# Altium schematic sheet Connectors.SchDoc
size A3
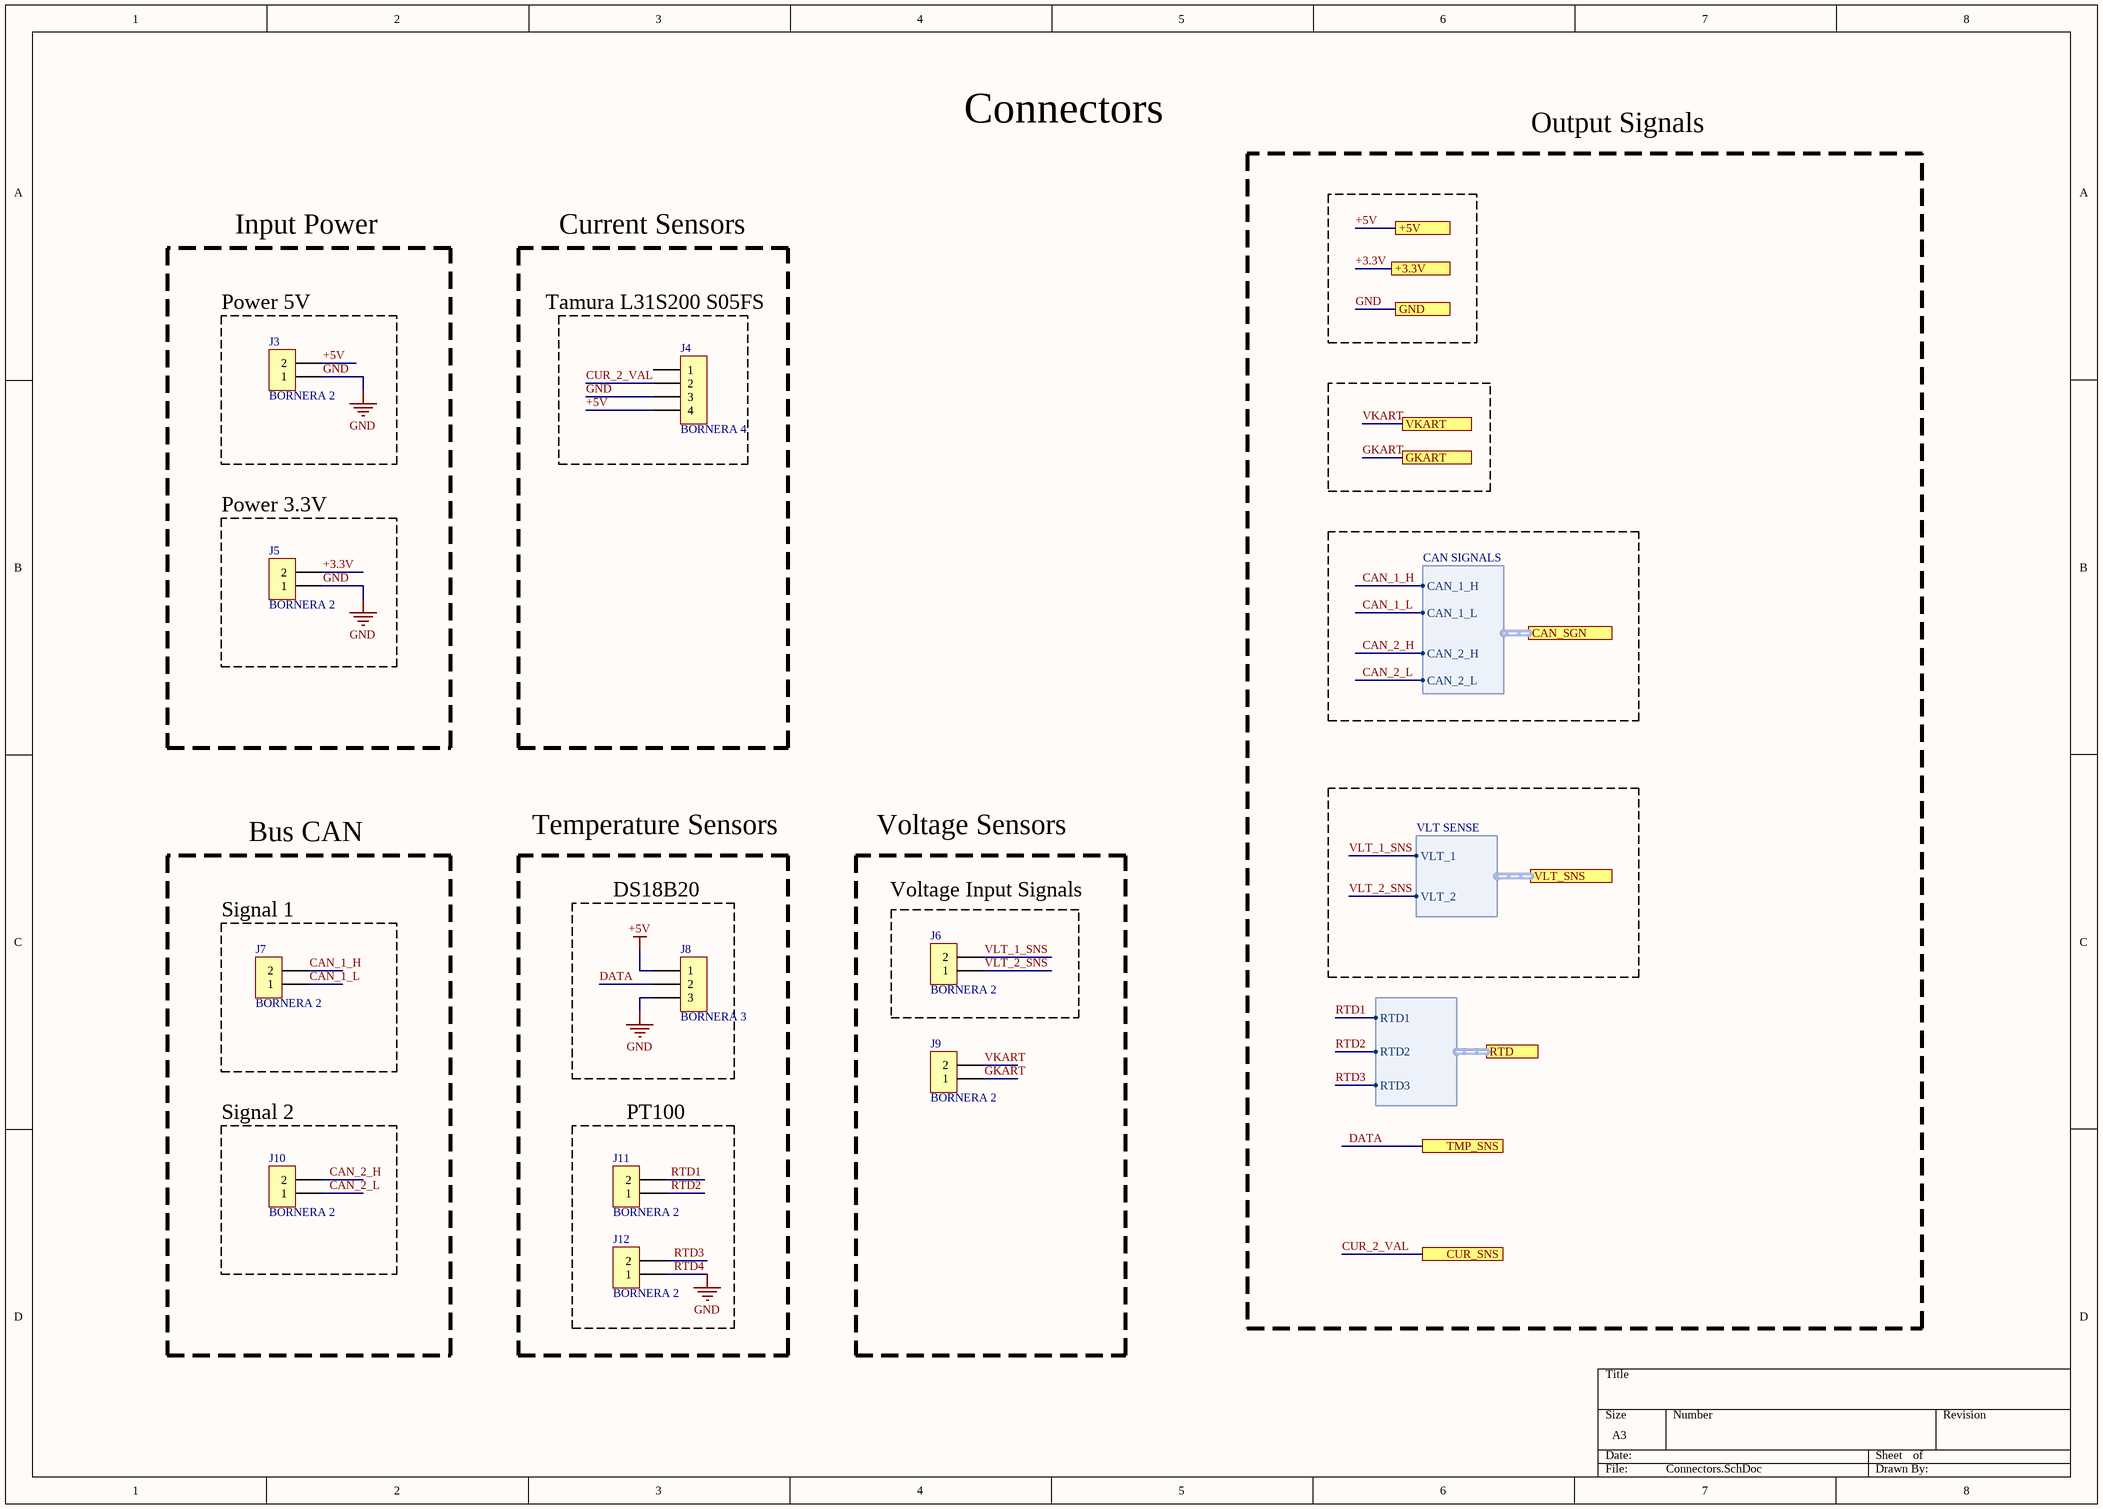
[diagram p0: Connectors.SchDoc]

## Parts
J3  BORNERA 2  [BORNERA2]
J4  BORNERA 4  [BORNERA4]
J5  BORNERA 2  [BORNERA2]
J6  BORNERA 2  [BORNERA2]
J7  BORNERA 2  [BORNERA2]
J8  BORNERA 3  [BORNERA3]
J9  BORNERA 2  [BORNERA2]
J10  BORNERA 2  [BORNERA2]
J11  BORNERA 2  [BORNERA2]
J12  BORNERA 2  [BORNERA2]

## Blocks framed on the sheet
Current Sensors: J4
Power 5V: J3
Power 3.3V: J5
Voltage Sensors: J9
Signal 1: J7
DS18B20: J8
Voltage Input Signals: J6
Signal 2: J10
PT100: J11 J12

## Ports
+3.3V, +5V, CAN_SGN (harness CAN SIGNALS), CUR_SNS, GKART, GND, RTD (harness *), TMP_SNS, VKART, VLT_SNS (harness VLT SENSE)

## Harnesses
?: RTD1, RTD2, RTD3
CAN SIGNALS: CAN_1_H, CAN_1_L, CAN_2_H, CAN_2_L
VLT SENSE: VLT_1, VLT_2

## Nets
+5V: J3.2 J4.4 J8.1 ; port +5V
GND: J3.1 J4.3 J5.1 J8.3 J12.1 ; port GND  [also labelled RTD4]
+3.3V: J5.2 ; port +3.3V
CAN_1_H: J7.2 ; port CAN_SGN.CAN_1_H
CAN_1_L: J7.1 ; port CAN_SGN.CAN_1_L
CAN_2_H: J10.2 ; port CAN_SGN.CAN_2_H
CAN_2_L: J10.1 ; port CAN_SGN.CAN_2_L
CUR_2_VAL: J4.2 ; port CUR_SNS
DATA: J8.2 ; port TMP_SNS
GKART: J9.1 ; port GKART
RTD1: J11.2 ; port RTD.RTD1
RTD2: J11.1 ; port RTD.RTD2
RTD3: J12.2 ; port RTD.RTD3
VKART: J9.2 ; port VKART
VLT_1_SNS: J6.2 ; port VLT_SNS.VLT_1
VLT_2_SNS: J6.1 ; port VLT_SNS.VLT_2

Not connected (* = marked no-connect by the designer): J4 1

## Notes on the sheet
- Connectors
- Output Signals
- Input Power
- Tamura L31S200 S05FS
- Bus CAN
- Temperature Sensors